# Altium project MX28X.PrjPcb
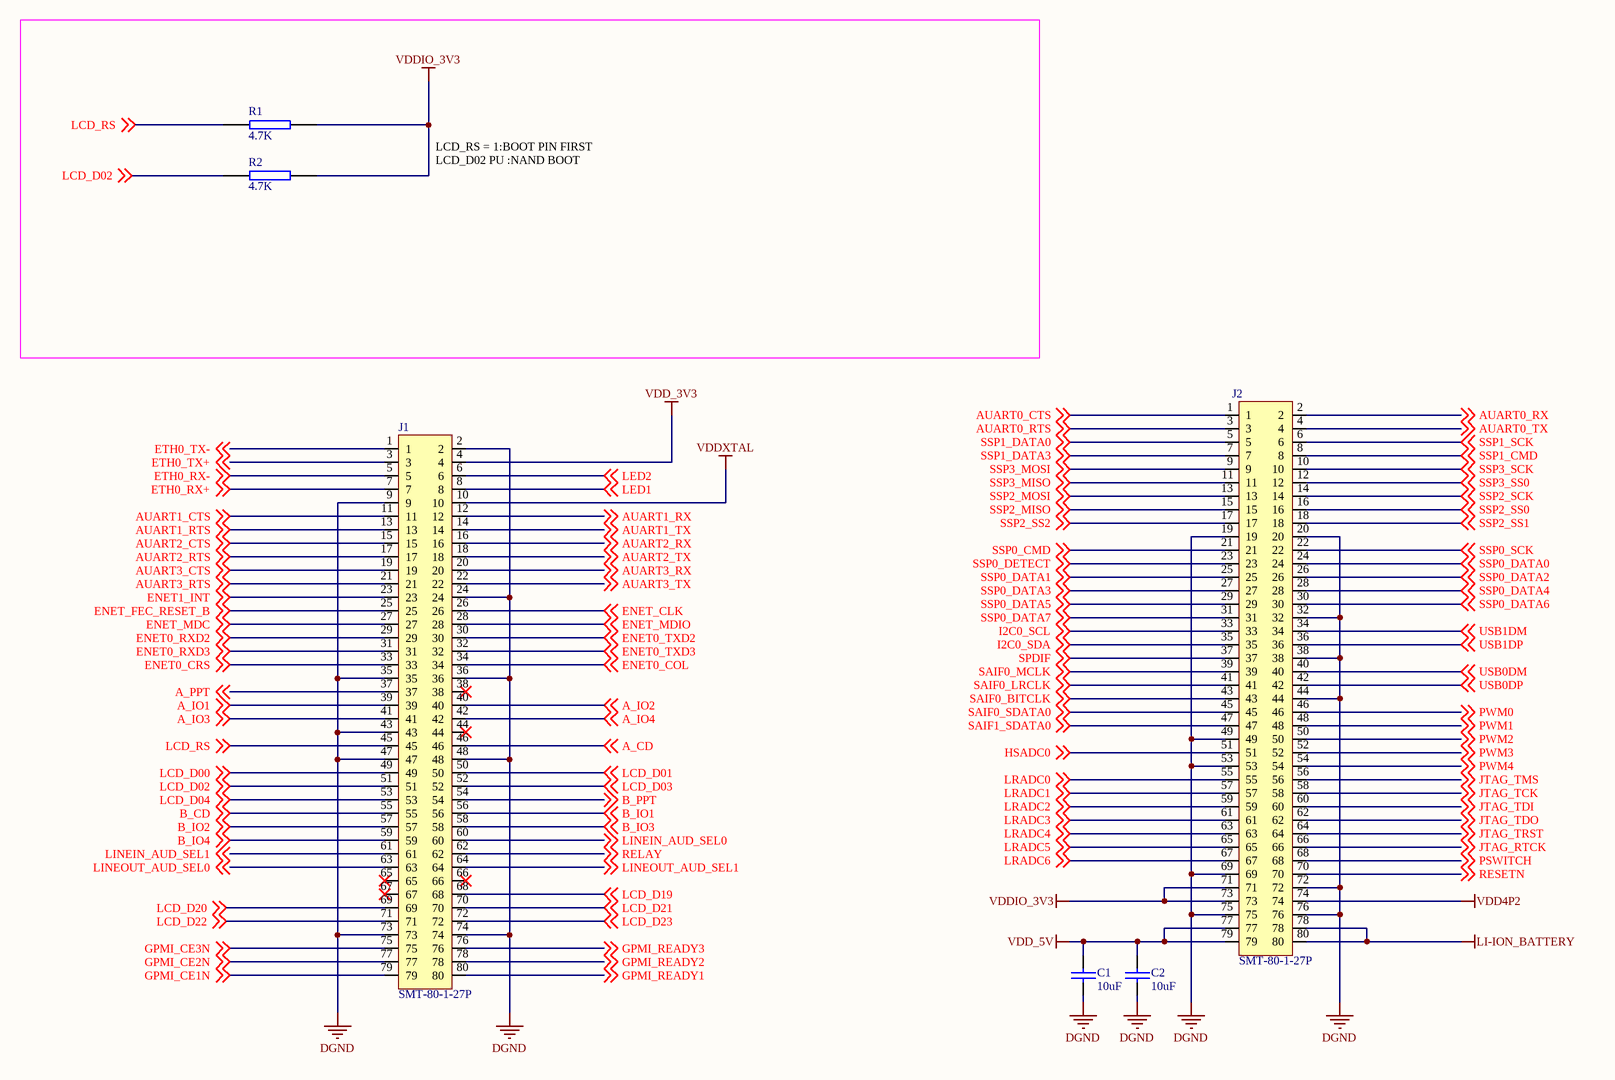
[diagram p0: BTB CONNECTOR.SchDoc]
2 sheets, 76 parts. Net scope: global (net labels, ports and power ports of the same name join across sheets).
Board file: DRS_SCH-2017-05-16.PcbDoc
Sheets:
  BTB CONNECTOR.SchDoc
  DRS_SCH-05-16.SchDoc

## Sheet BTB CONNECTOR.SchDoc
size A3

### Parts
C1  10uF  [C0805]
C2  10uF  [C0805]
J1  SMT-80-1-27P  [DB40X2-1.27]
J2  SMT-80-1-27P  [DB40X2-1.27]
R1  4.7K  [0603]
R2  4.7K  [0603]

### Nets
DGND: C1.2 C2.2 J1.2 J1.9 J1.24 J1.35 J1.36 J1.43 J1.47 J1.48 J1.73 J1.74 J2.19 J2.20 J2.32 J2.38 J2.44 J2.49 J2.53 J2.69 J2.72 J2.75 J2.76
LI-ION_BATTERY: J2.78 J2.80
VDD4P2: J2.74
VDD_3V3: J1.4
VDD_5V: C1.1 C2.1 J2.77 J2.79
VDDIO_3V3: J2.71 J2.73 R1.1 R2.1
VDDXTAL: J1.10
A_CD: J1.46 ; off-sheet A_CD
A_IO1: J1.39 ; off-sheet A_IO1
A_IO2: J1.40 ; off-sheet A_IO2
A_IO3: J1.41 ; off-sheet A_IO3
A_IO4: J1.42 ; off-sheet A_IO4
A_PPT: J1.37 ; off-sheet A_PPT
AUART0_CTS: J2.1 ; off-sheet AUART0_CTS
AUART0_RTS: J2.3 ; off-sheet AUART0_RTS
AUART0_RX: J2.2 ; off-sheet AUART0_RX
AUART0_TX: J2.4 ; off-sheet AUART0_TX
AUART1_CTS: J1.11 ; off-sheet AUART1_CTS
AUART1_RTS: J1.13 ; off-sheet AUART1_RTS
AUART1_RX: J1.12 ; off-sheet AUART1_RX
AUART1_TX: J1.14 ; off-sheet AUART1_TX
AUART2_CTS: J1.15 ; off-sheet AUART2_CTS
AUART2_RTS: J1.17 ; off-sheet AUART2_RTS
AUART2_RX: J1.16 ; off-sheet AUART2_RX
AUART2_TX: J1.18 ; off-sheet AUART2_TX
AUART3_CTS: J1.19 ; off-sheet AUART3_CTS
AUART3_RTS: J1.21 ; off-sheet AUART3_RTS
AUART3_RX: J1.20 ; off-sheet AUART3_RX
AUART3_TX: J1.22 ; off-sheet AUART3_TX
B_CD: J1.55 ; off-sheet B_CD
B_IO1: J1.56 ; off-sheet B_IO1
B_IO2: J1.57 ; off-sheet B_IO2
B_IO3: J1.58 ; off-sheet B_IO3
B_IO4: J1.59 ; off-sheet B_IO4
B_PPT: J1.54 ; off-sheet B_PPT
ENET0_COL: J1.34 ; off-sheet ENET0_COL
ENET0_CRS: J1.33 ; off-sheet ENET0_CRS
ENET0_RXD2: J1.29 ; off-sheet ENET0_RXD2
ENET0_RXD3: J1.31 ; off-sheet ENET0_RXD3
ENET0_TXD2: J1.30 ; off-sheet ENET0_TXD2
ENET0_TXD3: J1.32 ; off-sheet ENET0_TXD3
ENET1_INT: J1.23 ; off-sheet ENET1_INT
ENET_CLK: J1.26 ; off-sheet ENET_CLK
ENET_FEC_RESET_B: J1.25 ; off-sheet ENET_FEC_RESET_B
ENET_MDC: J1.27 ; off-sheet ENET_MDC
ENET_MDIO: J1.28 ; off-sheet ENET_MDIO
ETH0_RX+: J1.7 ; off-sheet ETH0_RX+
ETH0_RX-: J1.5 ; off-sheet ETH0_RX-
ETH0_TX+: J1.3 ; off-sheet ETH0_TX+
ETH0_TX-: J1.1 ; off-sheet ETH0_TX-
GPMI_CE1N: J1.79 ; off-sheet GPMI_CE1N
GPMI_CE2N: J1.77 ; off-sheet GPMI_CE2N
GPMI_CE3N: J1.75 ; off-sheet GPMI_CE3N
GPMI_READY1: J1.80 ; off-sheet GPMI_READY1
GPMI_READY2: J1.78 ; off-sheet GPMI_READY2
GPMI_READY3: J1.76 ; off-sheet GPMI_READY3
HSADC0: J2.51 ; off-sheet HSADC0
I2C0_SCL: J2.33 ; off-sheet I2C0_SCL
I2C0_SDA: J2.35 ; off-sheet I2C0_SDA
JTAG_RTCK: J2.66 ; off-sheet JTAG_RTCK
JTAG_TCK: J2.58 ; off-sheet JTAG_TCK
JTAG_TDI: J2.60 ; off-sheet JTAG_TDI
JTAG_TDO: J2.62 ; off-sheet JTAG_TDO
JTAG_TMS: J2.56 ; off-sheet JTAG_TMS
JTAG_TRST: J2.64 ; off-sheet JTAG_TRST
LCD_D00: J1.49 ; off-sheet LCD_D00
LCD_D01: J1.50 ; off-sheet LCD_D01
LCD_D02: J1.51 R2.2 ; off-sheet LCD_D02
LCD_D03: J1.52 ; off-sheet LCD_D03
LCD_D04: J1.53 ; off-sheet LCD_D04
LCD_D19: J1.68 ; off-sheet LCD_D19
LCD_D20: J1.69 ; off-sheet LCD_D20
LCD_D21: J1.70 ; off-sheet LCD_D21
LCD_D22: J1.71 ; off-sheet LCD_D22
LCD_D23: J1.72 ; off-sheet LCD_D23
LCD_RS: J1.45 R1.2 ; off-sheet LCD_RS
LED1: J1.8 ; off-sheet LED1
LED2: J1.6 ; off-sheet LED2
LINEIN_AUD_SEL0: J1.60 ; off-sheet LINEIN_AUD_SEL0
LINEIN_AUD_SEL1: J1.61 ; off-sheet LINEIN_AUD_SEL1
LINEOUT_AUD_SEL0: J1.63 ; off-sheet LINEOUT_AUD_SEL0
LINEOUT_AUD_SEL1: J1.64 ; off-sheet LINEOUT_AUD_SEL1
LRADC0: J2.55 ; off-sheet LRADC0
LRADC1: J2.57 ; off-sheet LRADC1
LRADC2: J2.59 ; off-sheet LRADC2
LRADC3: J2.61 ; off-sheet LRADC3
LRADC4: J2.63 ; off-sheet LRADC4
LRADC5: J2.65 ; off-sheet LRADC5
LRADC6: J2.67 ; off-sheet LRADC6
PSWITCH: J2.68 ; off-sheet PSWITCH
PWM0: J2.46 ; off-sheet PWM0
PWM1: J2.48 ; off-sheet PWM1
PWM2: J2.50 ; off-sheet PWM2
PWM3: J2.52 ; off-sheet PWM3
PWM4: J2.54 ; off-sheet PWM4
RELAY: J1.62 ; off-sheet RELAY
RESETN: J2.70 ; off-sheet RESETN
SAIF0_BITCLK: J2.43 ; off-sheet SAIF0_BITCLK
SAIF0_LRCLK: J2.41 ; off-sheet SAIF0_LRCLK
SAIF0_MCLK: J2.39 ; off-sheet SAIF0_MCLK
SAIF0_SDATA0: J2.45 ; off-sheet SAIF0_SDATA0
SAIF1_SDATA0: J2.47 ; off-sheet SAIF1_SDATA0
SPDIF: J2.37 ; off-sheet SPDIF
SSP0_CMD: J2.21 ; off-sheet SSP0_CMD
SSP0_DATA0: J2.24 ; off-sheet SSP0_DATA0
SSP0_DATA1: J2.25 ; off-sheet SSP0_DATA1
SSP0_DATA2: J2.26 ; off-sheet SSP0_DATA2
SSP0_DATA3: J2.27 ; off-sheet SSP0_DATA3
SSP0_DATA4: J2.28 ; off-sheet SSP0_DATA4
SSP0_DATA5: J2.29 ; off-sheet SSP0_DATA5
SSP0_DATA6: J2.30 ; off-sheet SSP0_DATA6
SSP0_DATA7: J2.31 ; off-sheet SSP0_DATA7
SSP0_DETECT: J2.23 ; off-sheet SSP0_DETECT
SSP0_SCK: J2.22 ; off-sheet SSP0_SCK
SSP1_CMD: J2.8 ; off-sheet SSP1_CMD
SSP1_DATA0: J2.5 ; off-sheet SSP1_DATA0
SSP1_DATA3: J2.7 ; off-sheet SSP1_DATA3
SSP1_SCK: J2.6 ; off-sheet SSP1_SCK
SSP2_MISO: J2.15 ; off-sheet SSP2_MISO
SSP2_MOSI: J2.13 ; off-sheet SSP2_MOSI
SSP2_SCK: J2.14 ; off-sheet SSP2_SCK
SSP2_SS0: J2.16 ; off-sheet SSP2_SS0
SSP2_SS1: J2.18 ; off-sheet SSP2_SS1
SSP2_SS2: J2.17 ; off-sheet SSP2_SS2
SSP3_MISO: J2.11 ; off-sheet SSP3_MISO
SSP3_MOSI: J2.9 ; off-sheet SSP3_MOSI
SSP3_SCK: J2.10 ; off-sheet SSP3_SCK
SSP3_SS0: J2.12 ; off-sheet SSP3_SS0
USB0DM: J2.40 ; off-sheet USB0DM
USB0DP: J2.42 ; off-sheet USB0DP
USB1DM: J2.34 ; off-sheet USB1DM
USB1DP: J2.36 ; off-sheet USB1DP

Not connected (* = marked no-connect by the designer): J1 38* 44* 65* 66* 67*

### Notes on the sheet
- LCD_RS = 1:BOOT PIN FIRST
  LCD_D02 PU :NAND BOOT

### Library data of the parts
C1 C2 = CAP: Capacitor
R1 R2 = RES2

## Sheet DRS_SCH-05-16.SchDoc
size A2
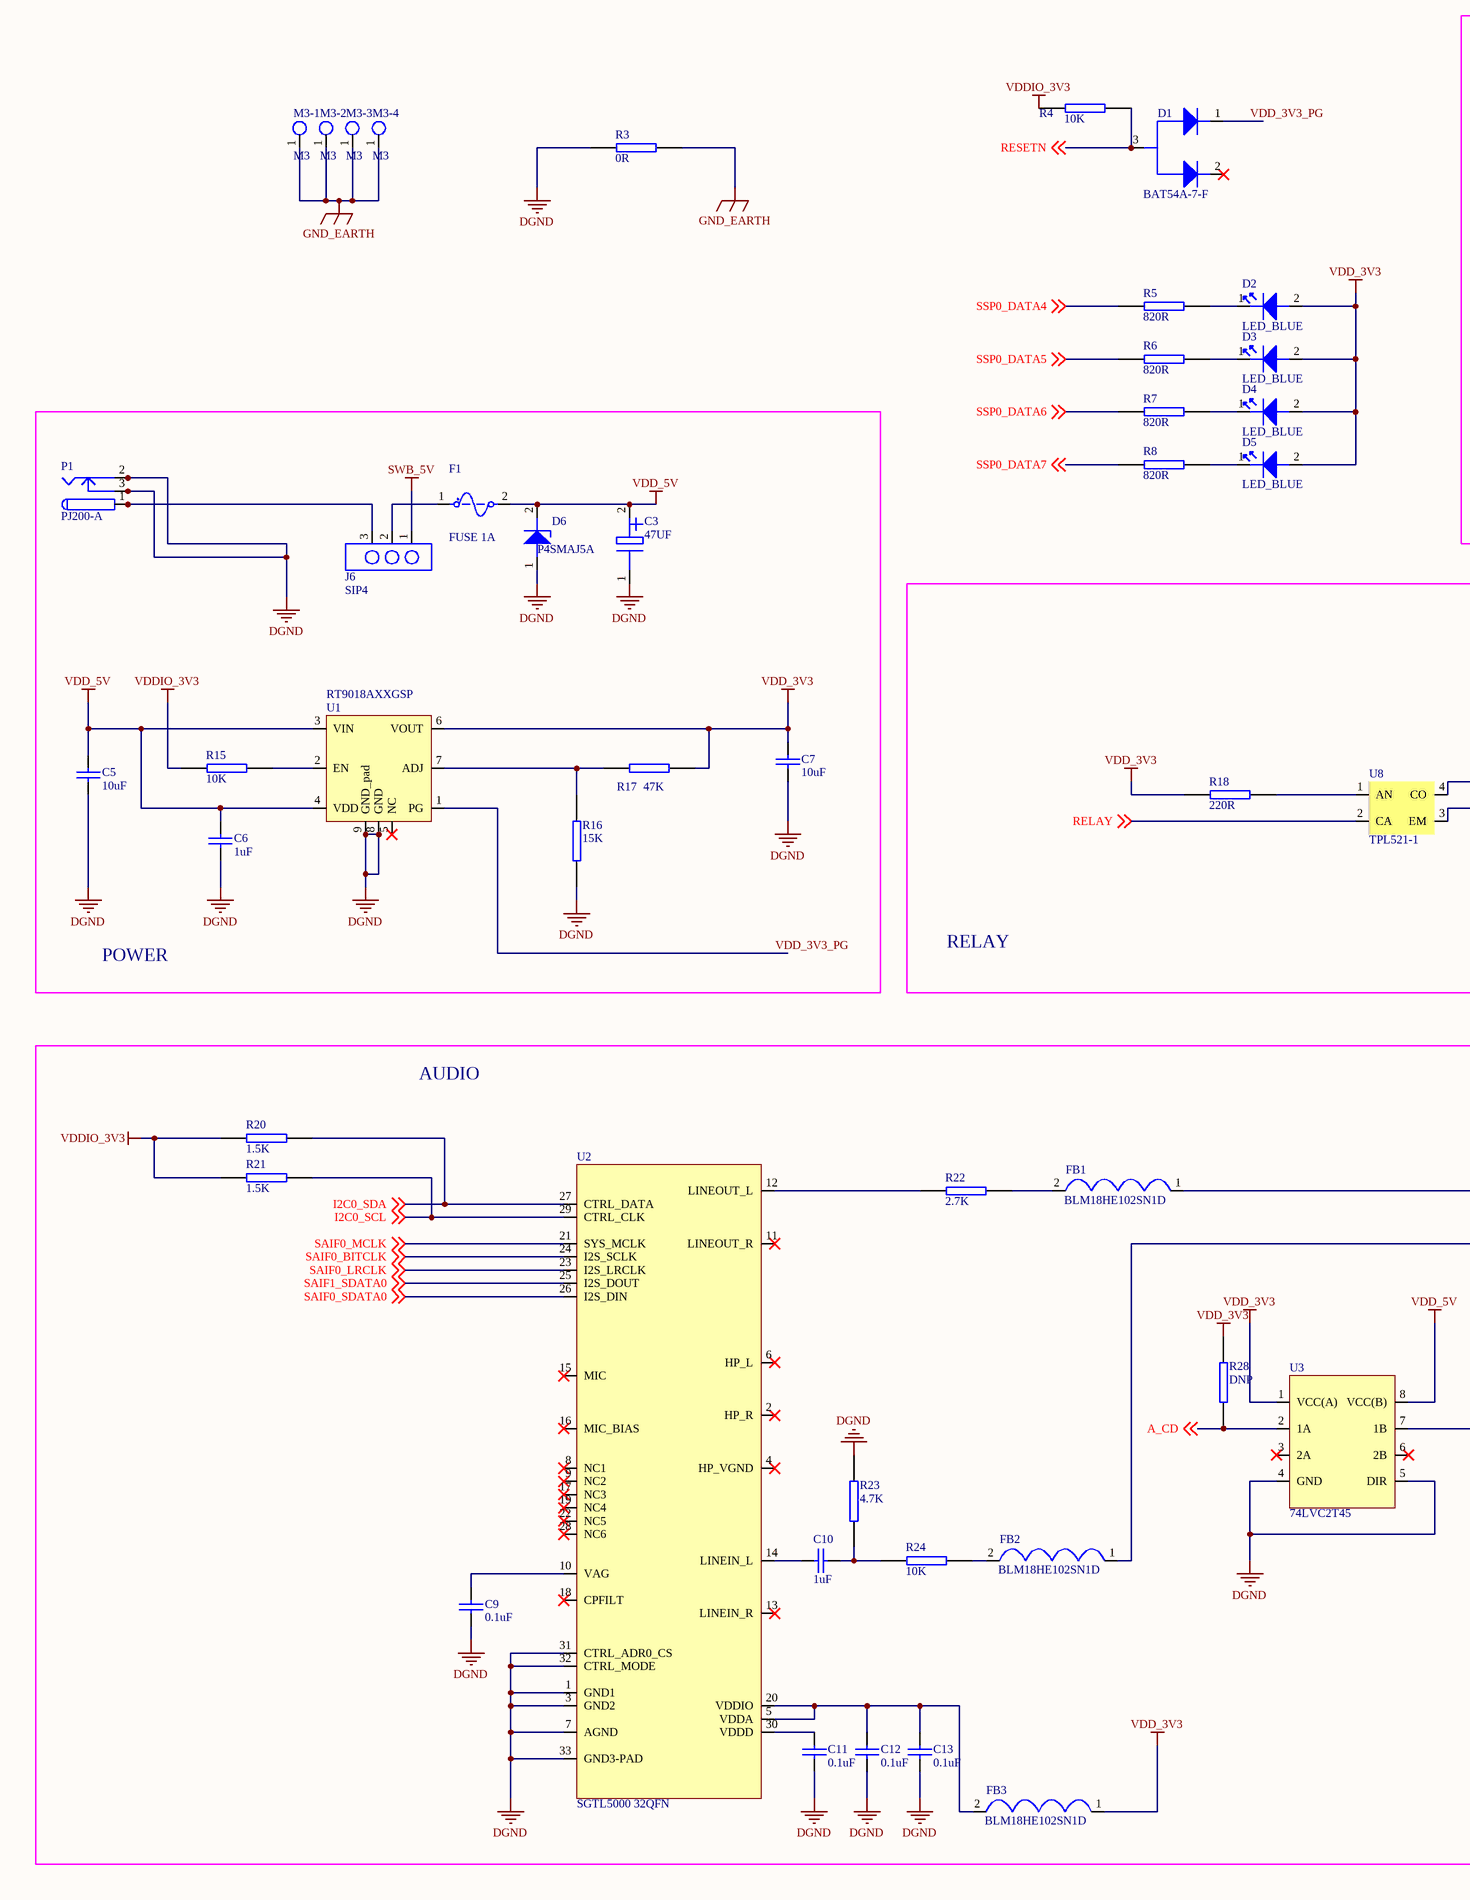
[diagram p1: DRS_SCH-05-16.SchDoc, left]
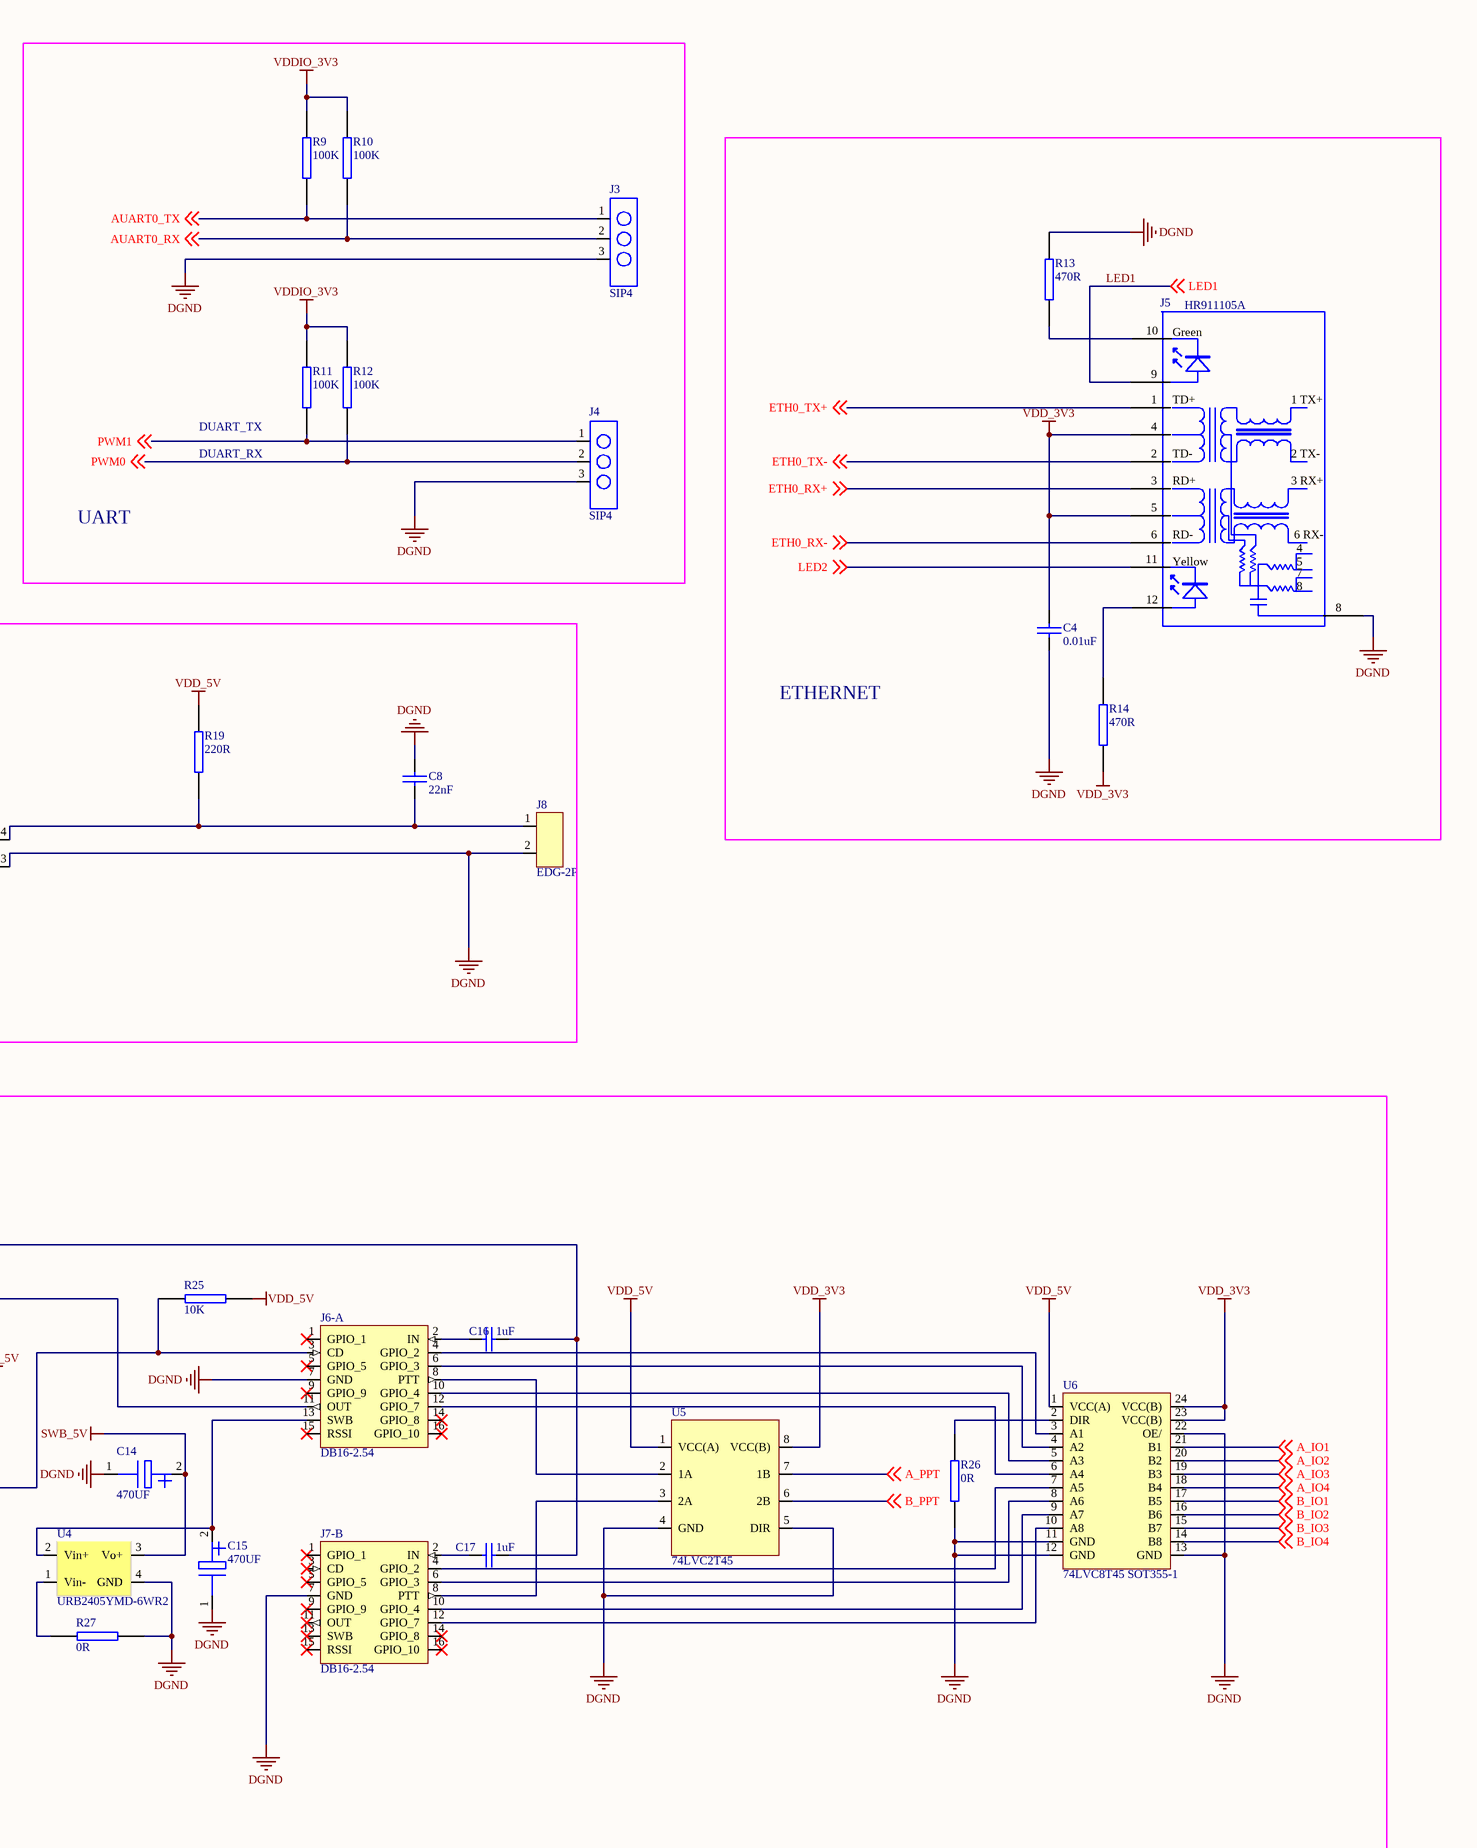
[diagram p2: DRS_SCH-05-16.SchDoc, right]

### Parts
C3  47UF  [RVT6.3]
C4  0.01uF  [0603]
C5  10uF  [C0805]
C6  1uF  [0603]
C7  10uF  [C0805]
C8  22nF  [0603]
C9  0.1uF  [0603]
C10  1uF  [0603]
C11  0.1uF  [0603]
C12  0.1uF  [0603]
C13  0.1uF  [0603]
C14  470UF  [RVT8]
C15  470UF  [RVT8]
C16  1uF  [0603]
C17  1uF  [0603]
D1  BAT54A-7-F  [S9013]
D2  LED_BLUE  [LED_BLUE]
D3  LED_BLUE  [LED_BLUE]
D4  LED_BLUE  [LED_BLUE]
D5  LED_BLUE  [LED_BLUE]
D6  P4SMAJ5A  [P4SMAJ5A]
F1  FUSE 1A  [FUSE 1A]
FB1  BLM18HE102SN1D  [0603]
FB2  BLM18HE102SN1D  [0603]
FB3  BLM18HE102SN1D  [0603]
J3  SIP4  [SIP3]
J4  SIP4  [SIP3]
J5  HR911105A  [HR911105A]
J6  SIP4  [SIP3]
J6-A  DB16-2.54  [DB2X8-2.54]
J7-B  DB16-2.54  [DB2X8-2.54]
J8  EDG-2P  [LZ1R-5.08-02P-140]
M3-1  M3  [M3]
M3-2  M3  [M3]
M3-3  M3  [M3]
M3-4  M3  [M3]
P1  PJ200-A  [KLD-0202]
R3  0R  [0603]
R4  10K  [0603]
R5  820R  [0603]
R6  820R  [0603]
R7  820R  [0603]
R8  820R  [0603]
R9  100K  [0603]
R10  100K  [0603]
R11  100K  [0603]
R12  100K  [0603]
R13  470R  [0603]
R14  470R  [0603]
R15  10K  [0603]
R16  15K  [0603]
R17  47K  [0603]
R18  220R  [0603]
R19  220R  [0603]
R20  1.5K  [0603]
R21  1.5K  [0603]
R22  2.7K  [0603]
R23  4.7K  [0603]
R24  10K  [0603]
R25  10K  [0603]
R26  0R  [0603]
R27  0R  [0603]
R28  DNP  [0603]
U1  RT9018AXXGSP  [RT9018]
U2  SGTL5000 32QFN  [SGTL5000 32QFN]
U3  74LVC2T45  [74LVC2T45]
U4  URB2405YMD-6WR2  [URB2405YMD-6WR2]
U5  74LVC2T45  [74LVC2T45]
U6  74LVC8T45 SOT355-1  [74LVC8T245]
U8  TPL521-1  [TPL521-1]

### Blocks framed on the sheet
UART: J3 J4 R9-R12
ETHERNET: C4 J5 R13 R14
POWER: C3 C5-C7 D6 F1 J6 P1 R15-R17 U1
RELAY: C8 J8 R18 R19 U8
AUDIO: C9-C17 FB1-FB3 J6-A J7-B R20-R28 U2-U6

### Nets
DGND: C3.1 C4.2 C5.2 C6.2 C7.2 C8.1 C9.1 C11.2 C12.2 C13.2 C14.1 C15.1 D6.1 J3.3 J4.3 J5.8 J6-A.7(GND) J7-B.7(GND) J8.2 P1.2 P1.2A P1.2B P1.3 P1.3A P1.3B R3.2 R13.2 R16.1 R23.2 R26.1 R27.1 U1.8(GND) U1.9(GND_pad) U2.1(GND1) U2.3(GND2) U2.7(AGND) U2.31(CTRL_ADR0_CS) U2.32(CTRL_MODE) U2.33(GND3-PAD) U3.4(GND) U3.5(DIR) U4.4(GND) U5.4(GND) U5.5(DIR) U6.11(GND) U6.12(GND) U6.13(GND) U6.22(OE/) U8.3(EM)
GND_EARTH: M3-1.1 M3-2.1 M3-3.1 M3-4.1 R3.1
SWB_5V: C14.2 J6.1 U4.3(Vo+)
VDD_3V3: C4.1 C7.1 D2.2 D3.2 D4.2 D5.2 FB3.1 J5.4 J5.5 R14.1 R17.2 R18.1 R28.1 U1.6(VOUT) U3.1(VCC(A)) U5.8(VCC(B)) U6.23(VCC(B)) U6.24(VCC(B))
VDD_5V: C3.2 C5.1 C6.1 D6.2 F1.2 R19.2 R25.1 U1.3(VIN) U1.4(VDD) U3.8(VCC(B)) U5.1(VCC(A)) U6.1(VCC(A))
VDDIO_3V3: R4.1 R9.2 R10.2 R11.2 R12.2 R15.2 R20.2 R21.2
A_CD: R28.2 U3.2(1A) ; off-sheet A_CD
A_IO1: U6.21(B1) ; off-sheet A_IO1
A_IO2: U6.20(B2) ; off-sheet A_IO2
A_IO3: U6.19(B3) ; off-sheet A_IO3
A_IO4: U6.18(B4) ; off-sheet A_IO4
A_PPT: U5.7(1B) ; off-sheet A_PPT
AUART0_RX: J3.2 R10.1 ; off-sheet AUART0_RX
AUART0_TX: J3.1 R9.1 ; off-sheet AUART0_TX
B_IO1: U6.17(B5) ; off-sheet B_IO1
B_IO2: U6.16(B6) ; off-sheet B_IO2
B_IO3: U6.15(B7) ; off-sheet B_IO3
B_IO4: U6.14(B8) ; off-sheet B_IO4
B_PPT: U5.6(2B) ; off-sheet B_PPT
ETH0_RX+: J5.3 ; off-sheet ETH0_RX+
ETH0_RX-: J5.6 ; off-sheet ETH0_RX-
ETH0_TX+: J5.1 ; off-sheet ETH0_TX+
ETH0_TX-: J5.2 ; off-sheet ETH0_TX-
I2C0_SCL: R21.1 U2.29(CTRL_CLK) ; off-sheet I2C0_SCL
I2C0_SDA: R20.1 U2.27(CTRL_DATA) ; off-sheet I2C0_SDA
LED1: J5.9 ; off-sheet LED1
LED2: J5.11 ; off-sheet LED2
PWM0: J4.2 R12.1 ; off-sheet PWM0
PWM1: J4.1 R11.1 ; off-sheet PWM1
RELAY: U8.2(CA) ; off-sheet RELAY
RESETN: D1.3 R4.2 ; off-sheet RESETN
SAIF0_BITCLK: U2.24(I2S_SCLK) ; off-sheet SAIF0_BITCLK
SAIF0_LRCLK: U2.23(I2S_LRCLK) ; off-sheet SAIF0_LRCLK
SAIF0_MCLK: U2.21(SYS_MCLK) ; off-sheet SAIF0_MCLK
SAIF0_SDATA0: U2.26(I2S_DIN) ; off-sheet SAIF0_SDATA0
SAIF1_SDATA0: U2.25(I2S_DOUT) ; off-sheet SAIF1_SDATA0
SSP0_DATA4: R5.1 ; off-sheet SSP0_DATA4
SSP0_DATA5: R6.1 ; off-sheet SSP0_DATA5
SSP0_DATA6: R7.1 ; off-sheet SSP0_DATA6
SSP0_DATA7: R8.1 ; off-sheet SSP0_DATA7
VDD_3V3_PG: D1.1 U1.1(PG)
NetC8_2: C8.2 J8.1 R19.1 U8.4(CO)
NetC9_2: C9.2 U2.10(VAG)
NetC10_1: C10.1 R23.1 R24.2
NetC10_2: C10.2 U2.14(LINEIN_L)
NetC11_1: C11.1 U2.30(VDDD)
NetC12_1: C12.1 C13.1 FB3.2 U2.5(VDDA) U2.20(VDDIO)
NetC15_2: C15.2 J6-A.13(SWB) U4.2(Vin+)
NetC16_1: C16.1 C17.1 FB1.1
NetC16_2: C16.2 J6-A.2(IN)
NetC17_2: C17.2 J7-B.2(IN)
NetD2_1: D2.1 R5.2
NetD3_1: D3.1 R6.2
NetD4_1: D4.1 R7.2
NetD5_1: D5.1 R8.2
NetF1_1: F1.1 J6.2
NetFB1_2: FB1.2 R22.1
NetFB2_1: FB2.1 J6-A.11(OUT)
NetFB2_2: FB2.2 R24.1
NetJ5_10: J5.10 R13.1
NetJ5_12: J5.12 R14.2
NetJ6-A_3: J6-A.3(CD) R25.2 U3.7(1B)
NetJ6-A_4: J6-A.4(GPIO_2) U6.3(A1)
NetJ6-A_6: J6-A.6(GPIO_3) U6.4(A2)
NetJ6-A_8: J6-A.8(PTT) U5.2(1A)
NetJ6-A_10: J6-A.10(GPIO_4) U6.5(A3)
NetJ6-A_12: J6-A.12(GPIO_7) U6.6(A4)
NetJ6_3: J6.3 P1.1 P1.1A P1.1B
NetJ7-B_4: J7-B.4(GPIO_2) U6.7(A5)
NetJ7-B_6: J7-B.6(GPIO_3) U6.8(A6)
NetJ7-B_8: J7-B.8(PTT) U5.3(2A)
NetJ7-B_10: J7-B.10(GPIO_4) U6.9(A7)
NetJ7-B_12: J7-B.12(GPIO_7) U6.10(A8)
NetR15_1: R15.1 U1.2(EN)
NetR16_2: R16.2 R17.1 U1.7(ADJ)
NetR18_2: R18.2 U8.1(AN)
NetR22_2: R22.2 U2.12(LINEOUT_L)
NetR26_2: R26.2 U6.2(DIR)
NetR27_2: R27.2 U4.1(Vin-)

Not connected (* = marked no-connect by the designer): D1 2*; J6-A 1(GPIO_1)* 5(GPIO_5)* 9(GPIO_9)* 14(GPIO_8)* 15(RSSI)* 16(GPIO_10)*; J7-B 1(GPIO_1)* 3(CD)* 5(GPIO_5)* 9(GPIO_9)* 11(OUT)* 13(SWB)* 14(GPIO_8)* 15(RSSI)* 16(GPIO_10)*; U1 5(NC)*; U2 2(HP_R)* 4(HP_VGND)* 6(HP_L)* 8(NC1)* 9(NC2)* 11(LINEOUT_R)* 13(LINEIN_R)* 15(MIC)* 16(MIC_BIAS)* 17(NC3)* 18(CPFILT)* 19(NC4)* 22(NC5)* 28(NC6)*; U3 3(2A)* 6(2B)*

### Notes on the sheet
- DUART_TX
- DUART_RX
- (in symbol HR911105A) Green; TD+; 1 TX+; TD-; 2 TX-; RD+; 3 RX+; RD-; 6 RX-; Yellow; 7

### Library data of the parts
C3 C14 C15 = 7343
C4-C13 C16 C17 = CAP: Capacitor
P1 = PWR2.5: Low Voltage Power Supply Connector; Published: 17-Dec-2003; DatasheetDocument: 09-May-2002; Publisher: Altium Limited; ComponentLink1Description: Manufacturer Link; ComponentLink1URL: http://domino.kycon.com/internet/Products.html
R3-R28 = RES2

## Nets that join several sheets
DGND: BTB CONNECTOR (23 pins), DRS_SCH-05-16 (49 pins)
VDD_3V3: BTB CONNECTOR (J1.4), DRS_SCH-05-16 (18 pins)
VDD_5V: BTB CONNECTOR (C1.1 C2.1 J2.77 J2.79), DRS_SCH-05-16 (12 pins)
VDDIO_3V3: BTB CONNECTOR (J2.71 J2.73 R1.1 R2.1), DRS_SCH-05-16 (8 pins)
A_CD: BTB CONNECTOR (J1.46), DRS_SCH-05-16 (R28.2 U3.2)
A_IO1: BTB CONNECTOR (J1.39), DRS_SCH-05-16 (U6.21)
A_IO2: BTB CONNECTOR (J1.40), DRS_SCH-05-16 (U6.20)
A_IO3: BTB CONNECTOR (J1.41), DRS_SCH-05-16 (U6.19)
A_IO4: BTB CONNECTOR (J1.42), DRS_SCH-05-16 (U6.18)
A_PPT: BTB CONNECTOR (J1.37), DRS_SCH-05-16 (U5.7)
AUART0_RX: BTB CONNECTOR (J2.2), DRS_SCH-05-16 (J3.2 R10.1)
AUART0_TX: BTB CONNECTOR (J2.4), DRS_SCH-05-16 (J3.1 R9.1)
B_IO1: BTB CONNECTOR (J1.56), DRS_SCH-05-16 (U6.17)
B_IO2: BTB CONNECTOR (J1.57), DRS_SCH-05-16 (U6.16)
B_IO3: BTB CONNECTOR (J1.58), DRS_SCH-05-16 (U6.15)
B_IO4: BTB CONNECTOR (J1.59), DRS_SCH-05-16 (U6.14)
B_PPT: BTB CONNECTOR (J1.54), DRS_SCH-05-16 (U5.6)
ETH0_RX+: BTB CONNECTOR (J1.7), DRS_SCH-05-16 (J5.3)
ETH0_RX-: BTB CONNECTOR (J1.5), DRS_SCH-05-16 (J5.6)
ETH0_TX+: BTB CONNECTOR (J1.3), DRS_SCH-05-16 (J5.1)
ETH0_TX-: BTB CONNECTOR (J1.1), DRS_SCH-05-16 (J5.2)
I2C0_SCL: BTB CONNECTOR (J2.33), DRS_SCH-05-16 (R21.1 U2.29)
I2C0_SDA: BTB CONNECTOR (J2.35), DRS_SCH-05-16 (R20.1 U2.27)
LED1: BTB CONNECTOR (J1.8), DRS_SCH-05-16 (J5.9)
LED2: BTB CONNECTOR (J1.6), DRS_SCH-05-16 (J5.11)
PWM0: BTB CONNECTOR (J2.46), DRS_SCH-05-16 (J4.2 R12.1)
PWM1: BTB CONNECTOR (J2.48), DRS_SCH-05-16 (J4.1 R11.1)
RELAY: BTB CONNECTOR (J1.62), DRS_SCH-05-16 (U8.2)
RESETN: BTB CONNECTOR (J2.70), DRS_SCH-05-16 (D1.3 R4.2)
SAIF0_BITCLK: BTB CONNECTOR (J2.43), DRS_SCH-05-16 (U2.24)
SAIF0_LRCLK: BTB CONNECTOR (J2.41), DRS_SCH-05-16 (U2.23)
SAIF0_MCLK: BTB CONNECTOR (J2.39), DRS_SCH-05-16 (U2.21)
SAIF0_SDATA0: BTB CONNECTOR (J2.45), DRS_SCH-05-16 (U2.26)
SAIF1_SDATA0: BTB CONNECTOR (J2.47), DRS_SCH-05-16 (U2.25)
SSP0_DATA4: BTB CONNECTOR (J2.28), DRS_SCH-05-16 (R5.1)
SSP0_DATA5: BTB CONNECTOR (J2.29), DRS_SCH-05-16 (R6.1)
SSP0_DATA6: BTB CONNECTOR (J2.30), DRS_SCH-05-16 (R7.1)
SSP0_DATA7: BTB CONNECTOR (J2.31), DRS_SCH-05-16 (R8.1)